# Altium schematic sheet 2CAN_Connectors.SchDoc
size A; SheetNumber: 4; SheetTotal: 3
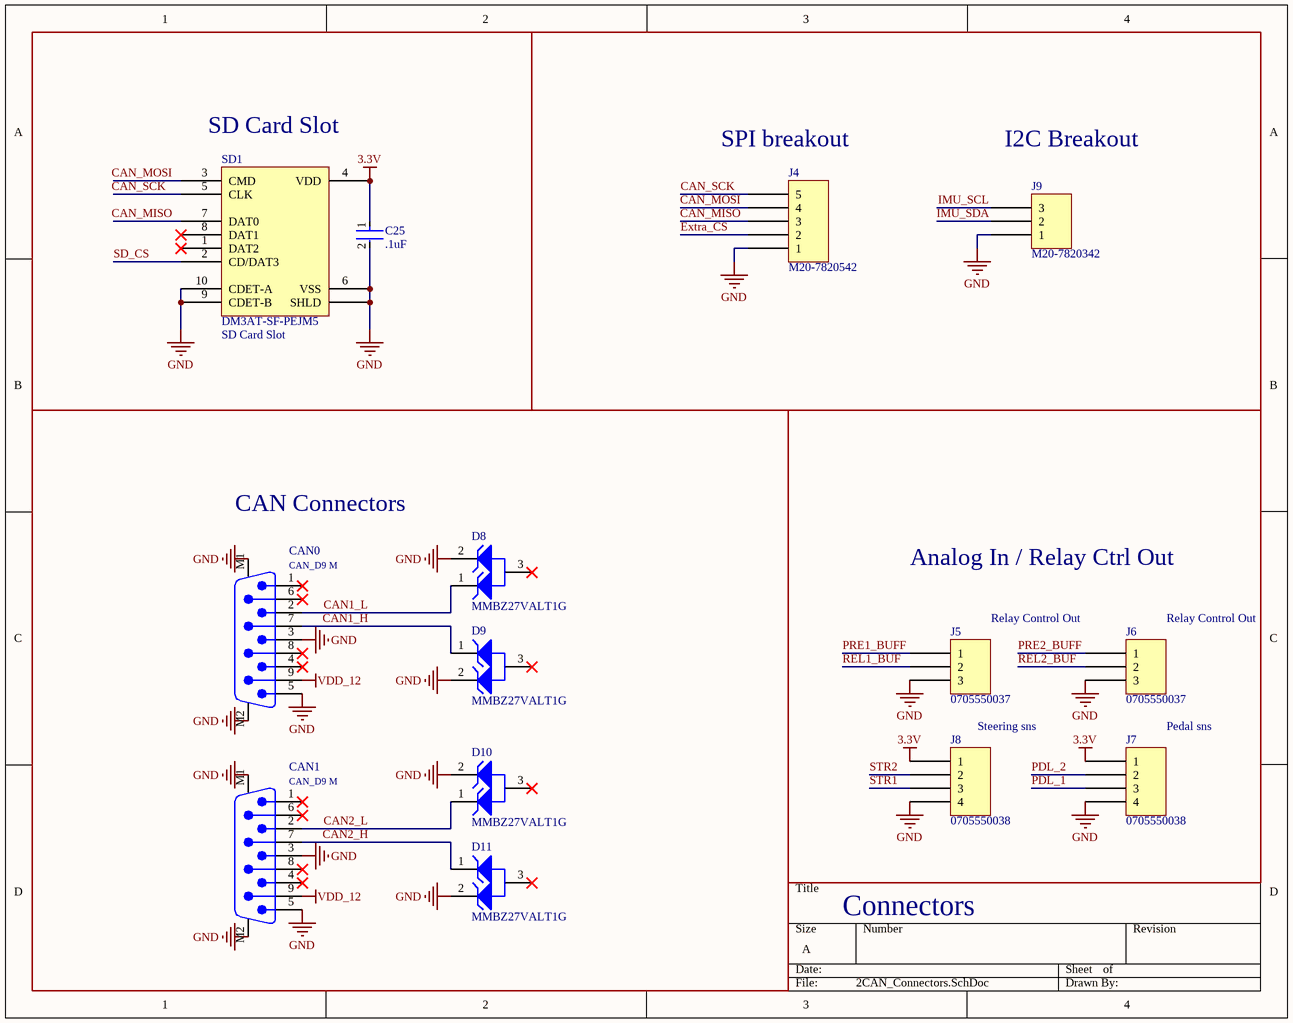
[diagram p0: 2CAN_Connectors.SchDoc]

## Parts
C25  .1uF  [FP-CGA3E-0_3-0_1-IPC_A]
CAN0  CAN_D9 M  [618009211721]
CAN1  CAN_D9 M  [618009211721]
D8  MMBZ27VALT1G  [ONSC-SOT-23-3-318-08_V]
D9  MMBZ27VALT1G  [ONSC-SOT-23-3-318-08_V]
D10  MMBZ27VALT1G  [ONSC-SOT-23-3-318-08_V]
D11  MMBZ27VALT1G  [ONSC-SOT-23-3-318-08_V]
J4  M20-7820542  [HARWIN M20-7820545]
J5  0705550037  [MOLEX SDA-70555-3PIN]
J6  0705550037  [MOLEX SDA-70555-3PIN]
J7  0705550038  [MOLEX SDA-70555-4PIN]
J8  0705550038  [MOLEX SDA-70555-4PIN]
J9  M20-7820342  [HARWIN M20-7820345]
SD1  DM3AT-SF-PEJM5  [HIROSE DM3AT-SF-PEJM5]

## Blocks framed on the sheet
SD Card Slot: C25 SD1
CAN Connectors: CAN0 CAN1 D8-D11
Analog In / Relay Ctrl Out: J5-J8

## Nets
3.3V: C25.1 J7.1 J8.1 SD1.4(VDD)
GND: C25.2 CAN0.3 CAN0.5 CAN0.M1 CAN0.M2 CAN1.3 CAN1.5 CAN1.M1 CAN1.M2 D8.2(K2) D9.2(K2) D10.2(K2) D11.2(K2) J4.1 J5.3 J6.3 J7.4 J8.4 J9.1 SD1.6(VSS) SD1.9(CDET-B) SD1.10(CDET-A) SD1.S(SHLD)
VDD_12: CAN0.9 CAN1.9
CAN1_H: CAN0.7 D9.1(K1)
CAN1_L: CAN0.2 D8.1(K1)
CAN2_H: CAN1.7 D11.1(K1)
CAN2_L: CAN1.2 D10.1(K1)
CAN_MISO: J4.3 SD1.7(DAT0)
CAN_MOSI: J4.4 SD1.3(CMD)
CAN_SCK: J4.5 SD1.5(CLK)
Extra_CS: J4.2
IMU_SCL: J9.3
IMU_SDA: J9.2
PDL_1: J7.3
PDL_2: J7.2
PRE1_BUFF: J5.1
PRE2_BUFF: J6.1
REL1_BUF: J5.2
REL2_BUF: J6.2
SD_CS: SD1.2(CD/DAT3)
STR1: J8.3
STR2: J8.2

Not connected (* = marked no-connect by the designer): CAN0 1* 4* 6* 8*; CAN1 1* 4* 6* 8*; D8 3(A)*; D9 3(A)*; D10 3(A)*; D11 3(A)*; SD1 1(DAT2)* 8(DAT1)*

## Notes on the sheet
- (near J4) SPI breakout
- I2C Breakout
- (near SD1) SD Card Slot
- (near J5) Relay Control Out
- (near J6) Relay Control Out
- Steering sns
- Pedal sns
- Connectors

## Library data of the parts
C25 = CMP-2000-07546-2: Cap Ceramic 100nF 50V X7R 10% Pad SMD 0603 +125°C Automotive T/R; Weight: 7.1E-05oz; Composition: Ceramic; Max Operating Temperature: 125°C; Termination: SMD/SMT; Dielectric: X7R; Length: 1.6mm; Package Quantity: 1; REACH SVHC: No SVHC; Lead Free: Lead Free; Case Code (Metric): 1608; Min Operating Temperature: -55°C; Packaging: Tape and Reel; Tolerance: 10%; Voltage Rating: 50V; Case Code (Imperial): 0603; Capacitance: 100nF; Case/Package: 0603; Voltage Rating (DC): 50V; Depth: 0.8mm; Radiation Hardening: No; Ratings: AEC-Q200; Mount: Surface Mount; Voltage: 50V; Thickness: 0.035inch; Width: 0.8mm; Height: 0.8mm
CAN0 CAN1 = CMP-1502-00292-1: Male PCB Connector without Hex Screw WR-DSUB, 8.08 mm, Angled, 9 pins; Manufacturer: Wurth Elektronik; Rated Current: 3A; Working Voltage: 125VAC; Pin Number: 9; Contact Resistance: 30mOhm; Publisher: WurthElektronik; Operating Temperature: -40to85degC; Part Number: 618009211721; Package Reference: 618009211721; Manufacturer URL: http://www.we-online.de; Mounting Technology: THT; Datasheet URL: https://katalog.we-online.de/em/datasheet/6180xx211721.pdf; Gender: Male; Packaging: Tray; Orientation: Angled
D8-D11 = CMP-1061-00658-1: 40 W Peak Power Zener Transient Voltage Suppressor, Dual Common Anode Zeners for ESD Protection, 3-Pin SOT-23, Pb-Free, Tape and Reel; Manufacturer: On Semiconductor; V(BR) Typ (V): 27; IR Max (uA): 0.05; Direction: Unidirectional; PPK Max (W): 40; DatasheetVersion: Rev. 13; ComponentLink3URL: http://www.onsemi.cn/pub_link/Collateral/318-08.PDF; ComponentLink2Description: Datasheet; ComponentLink1URL: http://www.onsemi.com/; ComponentLink2URL: http://www.onsemi.com/pub_link/Collateral/MMBZ5V6ALT1-D.PDF; PackageDescription: 3-Pin Small Outline Transistor, Body 2.92 x 1.3 mm, Pitch 0.95 mm; Mounting Technology: Surface Mount; ComponentLink3Description: Package Specification; Packing: Tape and Reel; ComponentLink1Description: Manufacturer URL; RoHS: Pb-Free; PackageReference: SOT-23-3-318-08; PartNumber: MMBZ27VALT1G; PackageVersion: Rev. AP, 11/2009
J4 = M20-7820542: CONN RCPT 5POS 0.1 GOLD PCB; Manufacturer: Harwin Inc.; Connector Type: Receptacle; Contact Length - Post: 0.118" (3.00mm); Current Rating (Amps): 3A; Mated Stacking Heights: 11.04mm, 12.63mm; Material Flammability Rating: UL94 V-0; Number of Positions: 5; Number of Positions Loaded: All; Pitch - Mating: 0.100" (2.54mm); Style: Board to Board or Cable; Part Number: M20-7820542; ComponentLink1Description: Datasheet; ComponentLink1URL: https://cdn.harwin.com/pdfs/Harwin_PC_Connectors_M20.pdf; ComponentLink2Description: DigiKey Link; ComponentLink2URL: https://www.digikey.com/en/products/detail/harwin-inc/M20-7820542/3727770; Contact Finish - Mating: Gold; Contact Finish - Post: Tin; Contact Finish Thickness - Mating: Flash; Contact Type: Female Socket; Fastening Type: Push-Pull; Insulation Color: Black; Insulation Height: 0.335" (8.51mm); LastUpdated: 9/21/2022 6:57:31 PM; Lifecycle Status: Active; Minimum Order: 1; Mounting Type: Through Hole; Number of Rows: 1; Operating Temperature: -40°C ~ 105°C; Packaging: Tube; Part Status: Active; Price: 0.50; Series: M20; Supplier 1: DigiKey; Supplier Part Number 1: 952-1801-ND; Termination: Solder
J5 J6 = 0705550037: CONN HEADER R/A 3POS 2.54MM; Manufacturer: Molex; Contact Length - Mating: 0.240" (6.10mm); Contact Length - Post: 0.130" (3.30mm); Material Flammability Rating: UL94 V-0; Number of Positions: 3; Number of Positions Loaded: All; Pitch - Mating: 0.100" (2.54mm); Shrouding: Shrouded - 4 Wall; Style: Board to Cable/Wire; Voltage Rating: 250V; Part Number: 0705550037; ComponentLink1Description: Datasheet; ComponentLink1URL: https://www.molex.com/pdm_docs/sd/705550037_sd.pdf; ComponentLink2Description: DigiKey Link; ComponentLink2URL: http://digikey.com/product-detail/en/molex/0705550037/WM4176-ND/1643410; Connector Type: Header; Contact Finish - Mating: Gold; Contact Finish - Post: Tin; Contact Finish Thickness - Mating: 15.0µin (0.38µm); Contact Material: Phosphor Bronze; Contact Shape: Square; Contact Type: Male Pin; Fastening Type: Latch Holder; Features: Board Guide; Insulation Color: Black; Insulation Height: 0.215" (5.45mm); Insulation Material: Polyester, Glass Filled; LastUpdated: 1/13/2020 12:03:13 AM; Lifecycle Status: Active; Minimum Order: 1; Mounting Type: Through Hole, Right Angle; Number of Rows: 1; Operating Temperature: -40°C ~ 105°C; Packaging: Tube; PartId: 94; Part Status: Active; Price: 1.03; Series: SL 70555; Supplier 1: DigiKey; Supplier Part Number 1: WM4176-ND; Termination: Solder
J7 J8 = 0705550038: CONN HEADER R/A 4POS 2.54MM; Manufacturer: Molex; Contact Length - Mating: 0.240" (6.10mm); Contact Length - Post: 0.130" (3.30mm); Material Flammability Rating: UL94 V-0; Number of Positions: 4; Number of Positions Loaded: All; Pitch - Mating: 0.100" (2.54mm); Shrouding: Shrouded - 4 Wall; Style: Board to Cable/Wire; Voltage Rating: 250V; Part Number: 0705550038; ComponentLink1Description: Datasheet; ComponentLink1URL: https://www.molex.com/pdm_docs/sd/705550038_sd.pdf; ComponentLink2Description: DigiKey Link; ComponentLink2URL: http://digikey.com/product-detail/en/molex/0705550038/WM4177-ND/1643411; Connector Type: Header; Contact Finish - Mating: Gold; Contact Finish - Post: Tin; Contact Finish Thickness - Mating: 15.0µin (0.38µm); Contact Material: Phosphor Bronze; Contact Shape: Square; Contact Type: Male Pin; Fastening Type: Latch Holder; Features: Board Guide; Insulation Color: Black; Insulation Height: 0.215" (5.45mm); Insulation Material: Polyester, Glass Filled; LastUpdated: 1/13/2020 12:03:50 AM; Lifecycle Status: Active; Minimum Order: 1; Mounting Type: Through Hole, Right Angle; Number of Rows: 1; Operating Temperature: -40°C ~ 105°C; Packaging: Tube; PartId: 97; Part Status: Active; Price: 1.30; Series: SL 70555; Supplier 1: DigiKey; Supplier Part Number 1: WM4177-ND; Termination: Solder
J9 = M20-7820342: CONN RCPT 3POS 0.1 GOLD PCB; Manufacturer: Harwin Inc.; Connector Type: Receptacle; Contact Length - Post: 0.118" (3.00mm); Current Rating (Amps): 3A; Mated Stacking Heights: 11.04mm, 12.63mm; Material Flammability Rating: UL94 V-0; Number of Positions: 3; Number of Positions Loaded: All; Pitch - Mating: 0.100" (2.54mm); Style: Board to Board or Cable; Part Number: M20-7820342; ComponentLink1Description: Datasheet; ComponentLink1URL: https://cdn.harwin.com/pdfs/Harwin_PC_Connectors_M20.pdf; ComponentLink2Description: DigiKey Link; ComponentLink2URL: https://www.digikey.com/en/products/detail/harwin-inc/M20-7820342/3727752; Contact Finish - Mating: Gold; Contact Finish - Post: Tin; Contact Finish Thickness - Mating: Flash; Contact Type: Female Socket; Fastening Type: Push-Pull; Insulation Color: Black; Insulation Height: 0.335" (8.51mm); LastUpdated: 9/21/2022 6:55:13 PM; Lifecycle Status: Active; Minimum Order: 1; Mounting Type: Through Hole; Number of Rows: 1; Operating Temperature: -40°C ~ 105°C; Packaging: Tube; Part Status: Active; Price: 0.42; Series: M20; Supplier 1: DigiKey; Supplier Part Number 1: 952-1783-ND; Termination: Solder
SD1 = DM3AT-SF-PEJM5: CONN MICRO SD CARD PUSH-PUSH R/A; Manufacturer: Hirose Electric Co Ltd; Card Type: Secure Digital - microSD™; Connector Type: Connector and Ejector; Insertion, Removal Method: Push In, Push Out; Number of Positions: 10 (8 + 2); Part Number: DM3AT-SF-PEJM5; ComponentLink1Description: Datasheet; ComponentLink1URL: https://www.hirose.com/product/document?clcode=CL0609-0033-6-00&productname=DM3AT-SF-PEJ2M5&series=DM3&documenttype=Catalog&lang=en&documentid=D49662_en; ComponentLink2Description: DigiKey Link; ComponentLink2URL: //digikey.com/product-detail/en/hirose-electric-co-ltd/DM3AT-SF-PEJM5/HR1964TR-ND/2533565; Contact Finish: Gold; Features: Switch; Height Above Board: 0.066" (1.68mm); LastUpdated: 12/16/2019 8:34:40 PM; Lifecycle Status: 0; Minimum Order: 1; Mounting Feature: Normal, Standard - Top; Mounting Type: Surface Mount, Right Angle; Packaging: TapeAndReel; Part Status: Active; Price: 1.41; Series: DM3; Supplier 1: DigiKey; Supplier Part Number 1: HR1964TR-ND